# EAGLE design Sam7s64 (EAGLE 6.5.0)
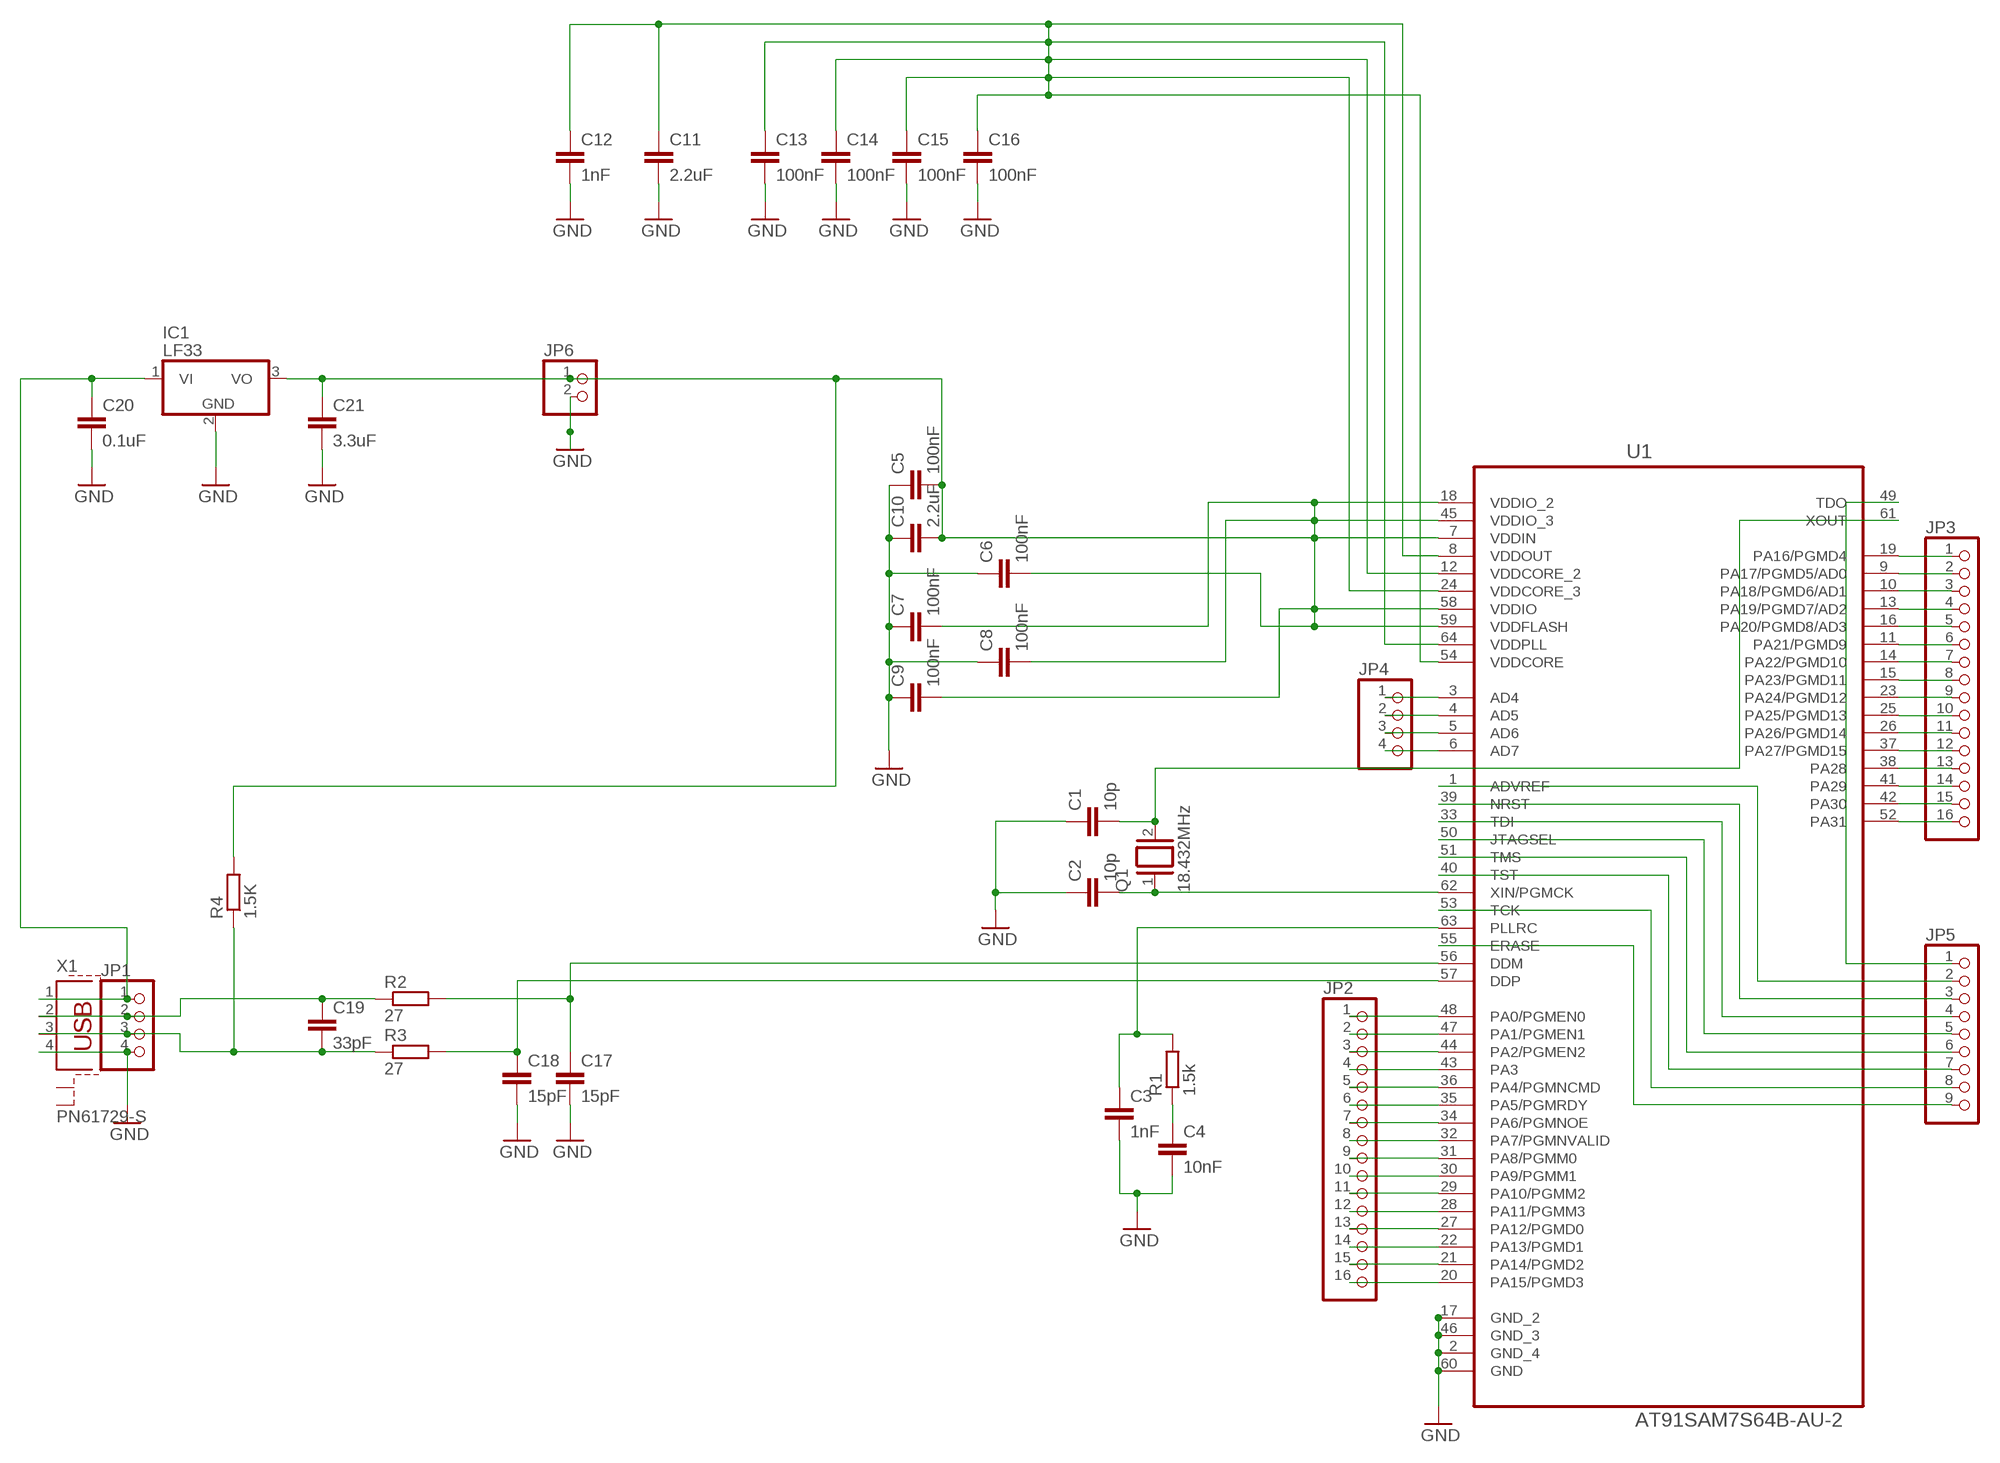
[diagram p0: schematic, sheet 1]

## Parts
C1  10p  C5/2.5  [C5B2.5]
C2  10p  C5/2.5  [C5B2.5]
C3  1nF  C5/2.5  [C5B2.5]
C4  10nF  C5/2.5  [C5B2.5]
C5  100nF  C5/2.5  [C5B2.5]
C6  100nF  C5/2.5  [C5B2.5]
C7  100nF  C5/2.5  [C5B2.5]
C8  100nF  C5/2.5  [C5B2.5]
C9  100nF  C5/2.5  [C5B2.5]
C10  2.2uF  C2.5/2  [C2.5-2]
C11  2.2uF  C2.5/2  [C2.5-2]
C12  1nF  C5/2.5  [C5B2.5]
C13  100nF  C5/2.5  [C5B2.5]
C14  100nF  C5/2.5  [C5B2.5]
C15  100nF  C5/2.5  [C5B2.5]
C16  100nF  C5/2.5  [C5B2.5]
C17  15pF  C5/2.5  [C5B2.5]
C18  15pF  C5/2.5  [C5B2.5]
C19  33pF  C5/2.5  [C5B2.5]
C20  0.1uF  C2.5/2  [C2.5-2]
C21  3.3uF  C2.5/2  [C2.5-2]
IC1  LF33  7805TV  [TO220V]
JP1  PINHD-1X4  [1X04]
JP2  PINHD-1X16  [1X16]
JP3  PINHD-1X16  [1X16]
JP4  PINHD-1X4  [1X04]
JP5  PINHD-1X9  [1X09]
JP6  PINHD-1X2  [1X02]
Q1  18.432MHz  XTAL/S  [QS]
R1  1.5k  R-EU_0207/10  [0207/10]
R2  27  R-EU_0207/10  [0207/10]
R3  27  R-EU_0207/10  [0207/10]
R4  1.5K  R-EU_0207/10  [0207/10]
U1  AT91SAM7S64B-AU-2  [QFP50P1200X1200X160-64N]
X1  PN61729-S  [PN61729-S]

## Nets
GND: C1.1 C2.1 C3.2 C4.2 C5.1 C6.1 C7.1 C8.1 C9.1 C10.1 C11.2 C12.2 C13.2 C14.2 C15.2 C16.2 C17.2 C18.2 C20.2 C21.2 IC1.2(GND) JP1.4 JP6.2 U1.2(GND_4) U1.17(GND_2) U1.46(GND_3) U1.60(GND) X1.4
N$1: C1.2 Q1.2 U1.61(XOUT)
N$2: C2.2 Q1.1 U1.62(XIN/PGMCK)
N$4: C17.1 R2.2 U1.56(DDM)
N$5: C3.1 R1.2 U1.63(PLLRC)
N$6: C5.2 C6.2 C7.2 C8.2 C9.2 C10.2 C21.1 IC1.3(VO) JP6.1 R4.2 U1.7(VDDIN) U1.18(VDDIO_2) U1.45(VDDIO_3) U1.58(VDDIO) U1.59(VDDFLASH)
N$7: C4.1 R1.1
N$9: C18.1 R3.2 U1.57(DDP)
N$11: C19.1 JP1.2 R2.1 X1.2
N$12: C19.2 JP1.3 R3.1 R4.1 X1.3
N$15: C20.1 IC1.1(VI) JP1.1 X1.1
N$16: C11.1 C12.1 C13.1 C14.1 C15.1 C16.1 U1.8(VDDOUT) U1.12(VDDCORE_2) U1.24(VDDCORE_3) U1.54(VDDCORE) U1.64(VDDPLL)
N$20: JP4.1 U1.3(AD4)
N$21: JP4.2 U1.4(AD5)
N$22: JP4.3 U1.5(AD6)
N$23: JP4.4 U1.6(AD7)
N$24: JP2.1 U1.48(PA0/PGMEN0)
N$25: JP2.2 U1.47(PA1/PGMEN1)
N$26: JP2.3 U1.44(PA2/PGMEN2)
N$27: JP2.4 U1.43(PA3)
N$28: JP2.5 U1.36(PA4/PGMNCMD)
N$29: JP2.6 U1.35(PA5/PGMRDY)
N$30: JP2.7 U1.34(PA6/PGMNOE)
N$31: JP2.8 U1.32(PA7/PGMNVALID)
N$32: JP2.9 U1.31(PA8/PGMM0)
N$33: JP2.10 U1.30(PA9/PGMM1)
N$34: JP2.11 U1.29(PA10/PGMM2)
N$35: JP2.12 U1.28(PA11/PGMM3)
N$36: JP2.13 U1.27(PA12/PGMD0)
N$37: JP2.14 U1.22(PA13/PGMD1)
N$38: JP2.15 U1.21(PA14/PGMD2)
N$39: JP2.16 U1.20(PA15/PGMD3)
N$40: JP3.1 U1.19(PA16/PGMD4)
N$41: JP3.2 U1.9(PA17/PGMD5/AD0)
N$42: JP3.3 U1.10(PA18/PGMD6/AD1)
N$43: JP3.4 U1.13(PA19/PGMD7/AD2)
N$44: JP3.5 U1.16(PA20/PGMD8/AD3)
N$45: JP3.6 U1.11(PA21/PGMD9)
N$46: JP3.7 U1.14(PA22/PGMD10)
N$47: JP3.8 U1.15(PA23/PGMD11)
N$48: JP3.9 U1.23(PA24/PGMD12)
N$49: JP5.2 U1.1(ADVREF)
N$50: JP5.3 U1.39(NRST)
N$51: JP5.4 U1.33(TDI)
N$52: JP5.5 U1.50(JTAGSEL)
N$53: JP5.6 U1.51(TMS)
N$54: JP5.7 U1.40(TST)
N$55: JP5.8 U1.53(TCK)
N$56: JP5.9 U1.55(ERASE)
N$57: JP5.1 U1.49(TDO)
N$58: JP3.10 U1.25(PA25/PGMD13)
N$59: JP3.11 U1.26(PA26/PGMD14)
N$60: JP3.12 U1.37(PA27/PGMD15)
N$61: JP3.13 U1.38(PA28)
N$62: JP3.14 U1.41(PA29)
N$63: JP3.15 U1.42(PA30)
N$64: JP3.16 U1.52(PA31)
Unconnected: X1.S1 X1.S2

## Library data of the parts
C1-C21 = 0myLib:C: CAPACITOR naming: grid - package width
IC1 = 0myLib:78*: Positive VOLTAGE REGULATOR Source: http://cache.national.com/ds/LM/LM78L05.pdf http://www.fairchildsemi.com/ds/LM/LM7805.pdf
JP1 JP4 = 0myLib:PINHD-1X4: PIN HEADER
JP2 JP3 = 0myLib:PINHD-1X16: PIN HEADER
JP5 = 0myLib:PINHD-1X9: PIN HEADER
JP6 = 0myLib:PINHD-1X2: PIN HEADER
Q1 = 0myLib:XTAL/S: CRYSTAL
R1-R4 = 0myLib:R-EU_: RESISTOR, European symbol
U1 = 0myLib:AT91SAM7S64B-AU-2: AT91 ARM Thumb-based Microcontrollers; DESCRIPTION: AT91 ARM Thumb-based Microcontrollers; MPN: AT91SAM7S64B-AU; OC_FARNELL: 1699393; OC_NEWARK: -; PACKAGE: QFP-64; SUPPLIER: Atmel
X1 = 0myLib:PN61729-S: BERG USB connector; OC_FARNELL: unknown; OC_NEWARK: unknown

## Board
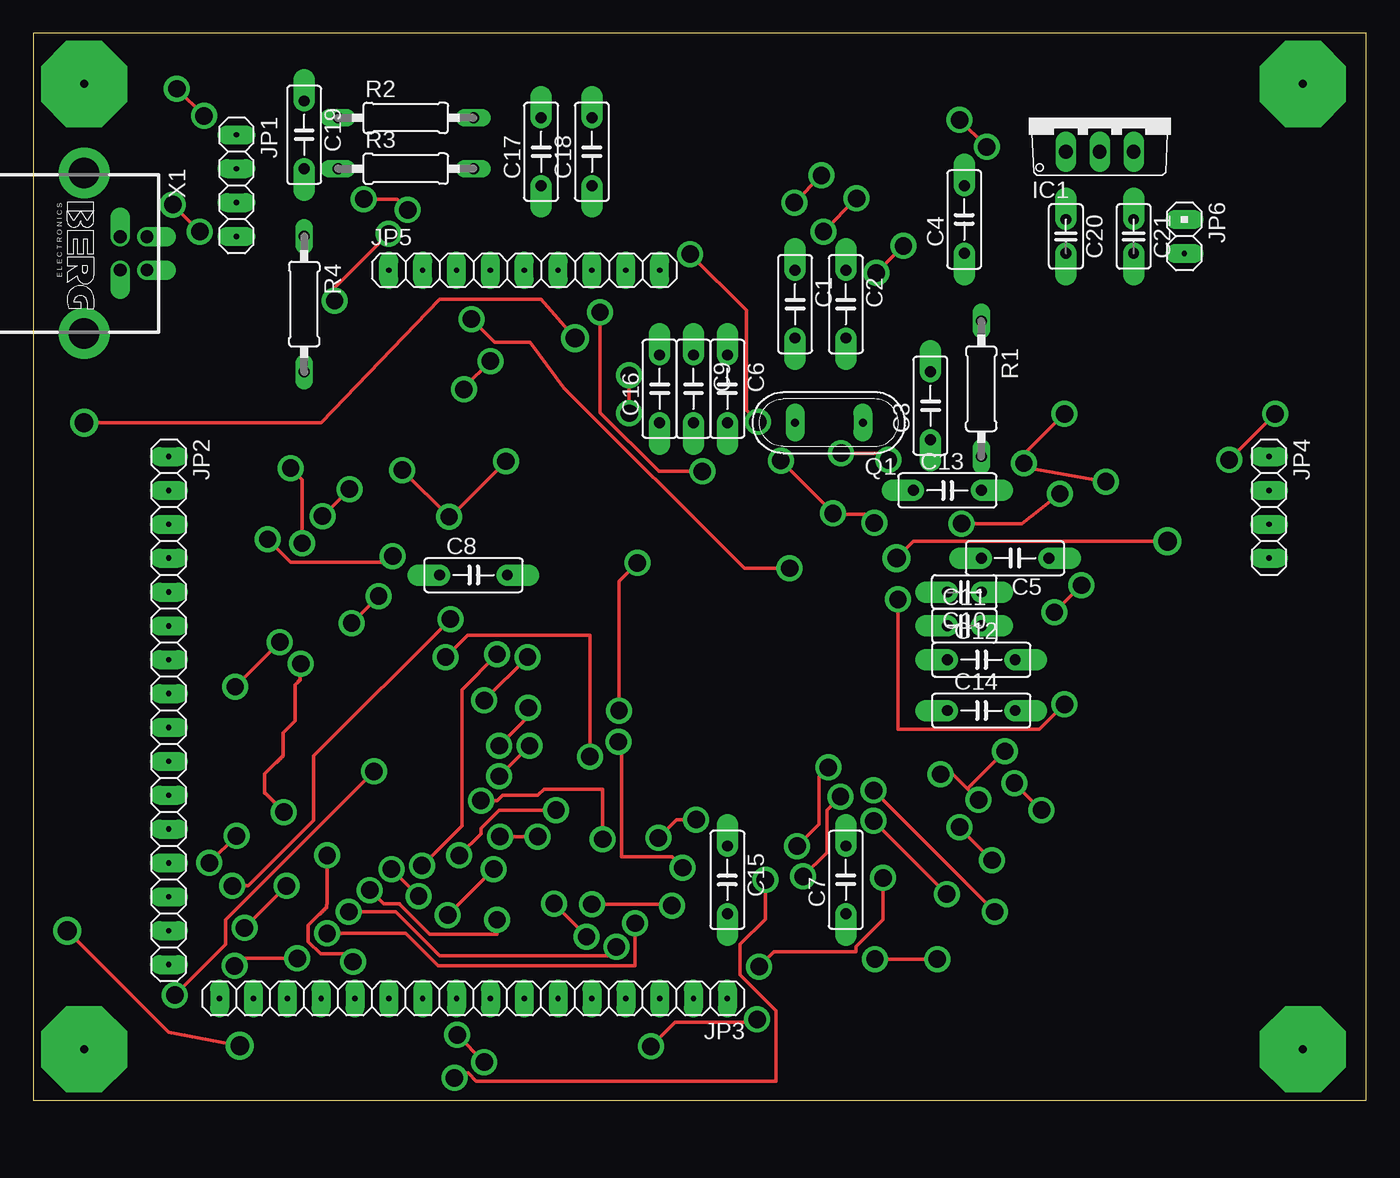
[diagram p1: board, top side]
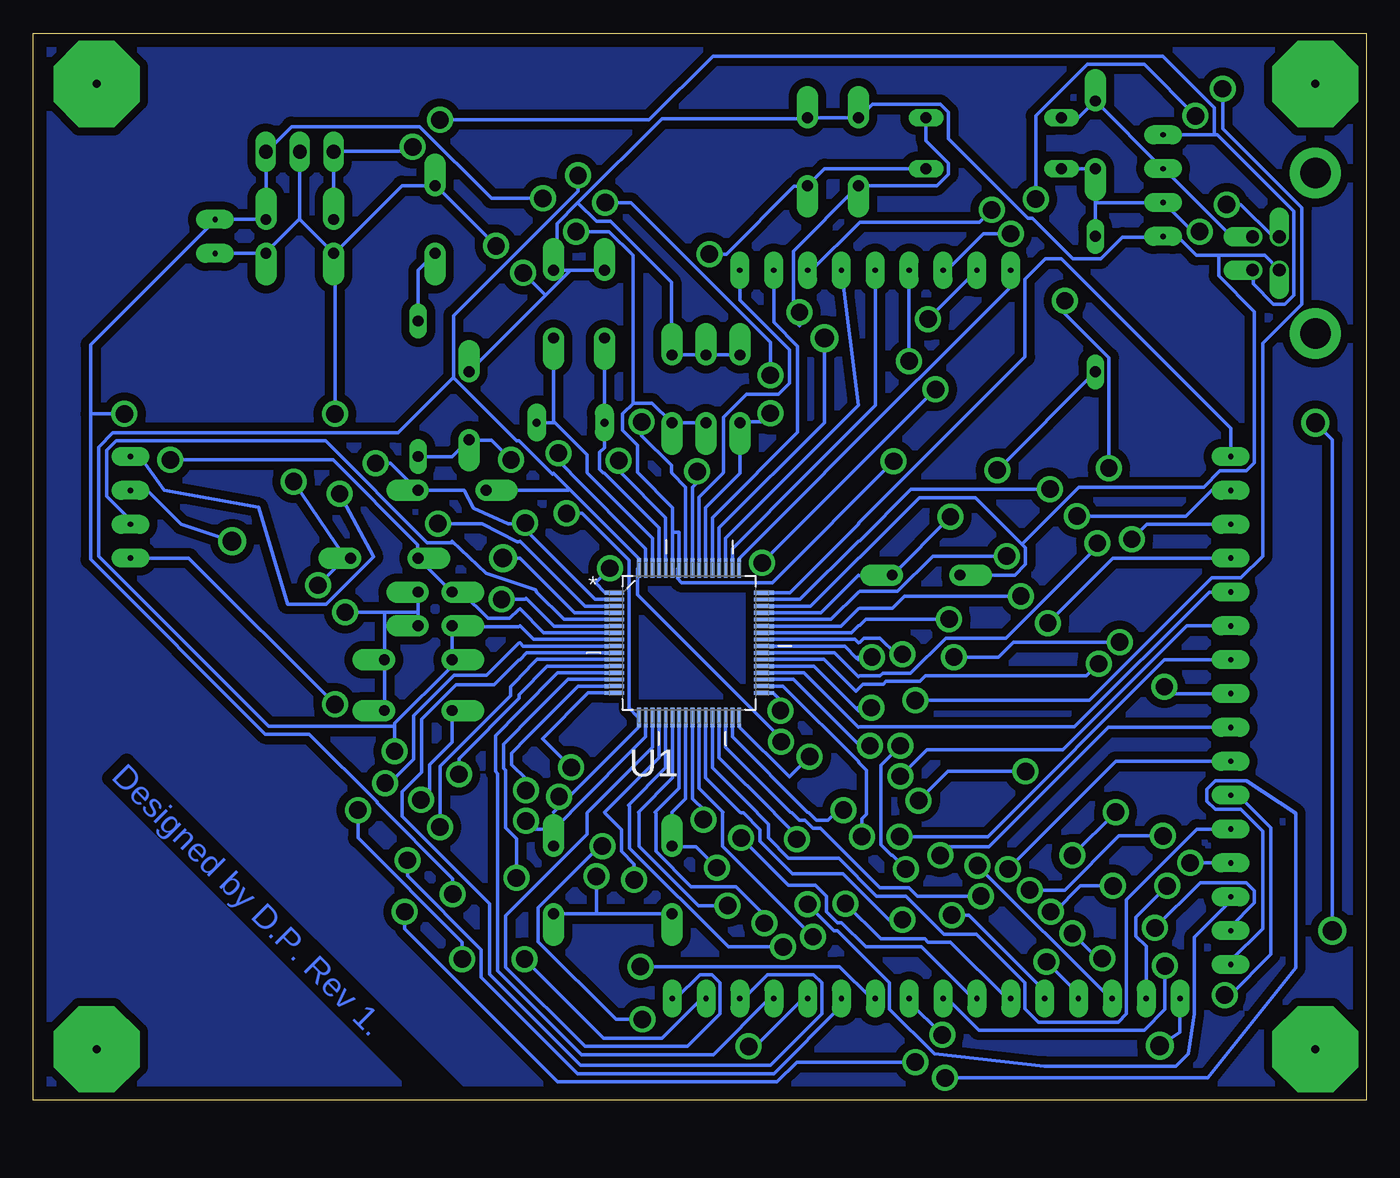
[diagram p2: board, bottom side, seen from below]

Size 100 x 80 mm. Coordinates in mm from the lower left corner, seen from the top.
Outline: 0,0 100,0 100,80 0,80 0,0
Copper layers (1*16): Top 0.035mm / dielectric 1.5mm / Bottom 0.035mm
Design rules "Design4_SMD *": minimum track width 11mil, minimum drill 1.3mm, track to track 24mil, track to pad 24mil, pad to pad 24mil, via to via 24mil, smd to smd 24mil, copper to edge 40mil, drill to drill 20mil, minimum pad ring 10mil, minimum via ring 10mil, stop-mask expansion 4mil, vias tented up to drill 0mil, thermal gap 10mil
tRestrict: area 14,63.5 to 16.5,73.7; area 6.3,59.7 to 8.9,67.3; area 19.1,68.6 to 21.6,76.2; area 21.6,68.6 to 34.3,74.9; area 38.1,67.3 to 43.2,76.2; area 25.4,61 to 48.3,63.5; area 19.1,53.3 to 21.6,66; area 45.7,49.5 to 53.3,57.2; area 55.9,55.9 to 62.2,63.5; area 55.9,49.5 to 63.5,52.1; area 68.6,62.2 to 71.1,69.8; area 69.8,47 to 72.4,59.7; 12 more areas
vRestrict: area 44.5,29.2 to 54.6,39.4; area 14,63.5 to 16.5,73.7; area 6.3,59.7 to 8.9,67.3; area 14,63.5 to 16.5,73.7; area 19.1,68.6 to 21.6,76.2; area 21.6,68.6 to 34.3,74.9; area 38.1,67.3 to 41.9,76.2; area 76.2,69.8 to 82.5,72.4; area 68.6,62.2 to 71.1,69.8; area 55.9,55.9 to 62.2,63.5; area 45.7,49.5 to 53.3,57.2; area 55.9,49.5 to 63.5,52.1; 14 more areas

### Footprints (pad centres in the part's own frame; a part is rotated, then mirrored left to right if it is on the bottom)
C5B2.5 = drill 0.813 pad 1.6 offset: 1 -2.54,0; 2 2.54,0
C2.5-2 = drill 0.813 pad 1.6 offset: 1 -1.27,0; 2 1.27,0
TO220V = drill 1.016 long: 1 -2.54,-2.54; 2 0,-2.54; 3 2.54,-2.54
1X04 = drill 0.4 pad 1.422 long: 1 -3.81,0; 2 -1.27,0; 3 1.27,0; 4 3.81,0
1X16 = drill 0.4 pad 1.422 long: 1 -19.05,0; 2 -16.51,0; 3 -13.97,0; 4 -11.43,0; 5 -8.89,0; 6 -6.35,0; 7 -3.81,0; 8 -1.27,0; 9 1.27,0; 10 3.81,0; 11 6.35,0; 12 8.89,0; 13 11.43,0; 14 13.97,0; 15 16.51,0; 16 19.05,0
1X09 = drill 0.4 pad 1.422 long: 1 -10.16,0; 2 -7.62,0; 3 -5.08,0; 4 -2.54,0; 5 0,0; 6 2.54,0; 7 5.08,0; 8 7.62,0; 9 10.16,0
1X02 = drill 0.4 pad 1.422 long: 1 -1.27,0; 2 1.27,0
QS = drill 0.61 pad 1.422 long: 1 -2.54,0; 2 2.54,0
0207/10 = drill 0.813 long: 1 -5.08,0; 2 5.08,0
QFP50P1200X1200X160-64N = smd 1.473 x 0.279: 1 -5.613,3.759; 2 -5.613,3.251; 3 -5.613,2.743; 4 -5.613,2.261; 5 -5.613,1.753; 6 -5.613,1.245; 7 -5.613,0.762; 8 -5.613,0.254; 9 -5.613,-0.254; 10 -5.613,-0.762; 11 -5.613,-1.245; 12 -5.613,-1.753; 13 -5.613,-2.261; 14 -5.613,-2.743; 15 -5.613,-3.251; 16 -5.613,-3.759; 33 5.613,-3.759; 34 5.613,-3.251; 35 5.613,-2.743; 36 5.613,-2.261; 37 5.613,-1.753; 38 5.613,-1.245; 39 5.613,-0.762; 40 5.613,-0.254; 41 5.613,0.254; 42 5.613,0.762; 43 5.613,1.245; 44 5.613,1.753; 45 5.613,2.261; 46 5.613,2.743; 47 5.613,3.251; 48 5.613,3.759 | smd 0.279 x 1.473: 17 -3.759,-5.613; 18 -3.251,-5.613; 19 -2.743,-5.613; 20 -2.261,-5.613; 21 -1.753,-5.613; 22 -1.245,-5.613; 23 -0.762,-5.613; 24 -0.254,-5.613; 25 0.254,-5.613; 26 0.762,-5.613; 27 1.245,-5.613; 28 1.753,-5.613; 29 2.261,-5.613; 30 2.743,-5.613; 31 3.251,-5.613; 32 3.759,-5.613; 49 3.759,5.613; 50 3.251,5.613; 51 2.743,5.613; 52 2.261,5.613; 53 1.753,5.613; 54 1.245,5.613; 55 0.762,5.613; 56 0.254,5.613; 57 -0.254,5.613; 58 -0.762,5.613; 59 -1.245,5.613; 60 -1.753,5.613; 61 -2.261,5.613; 62 -2.743,5.613; 63 -3.251,5.613; 64 -3.759,5.613
PN61729-S = drill 0.95 offset: 1 1.25,4.71; 2 -1.25,4.71; 3 -1.25,2.71; 4 1.25,2.71 | drill 2.3 pad 3.81: S1 -6.02,0; S2 6.02,0

### Placement (x,y rotation side)
C1  57.15,59.69 270 top
C2  60.96,59.69 270 top
C3  67.31,52.07 90 top
C4  69.85,66.04 90 top
C5  73.66,40.64 180 top
C6  52.07,53.34 270 top
C7  60.96,16.51 90 top
C8  33.02,39.37 0 top
C9  49.53,53.34 270 top
C10  69.85,38.1 180 top
C11  69.85,35.56 0 top
C12  71.12,33.02 0 top
C13  68.58,45.72 0 top
C14  71.12,29.21 0 top
C15  52.07,16.51 270 top
C16  46.99,53.34 90 top
C17  38.1,71.12 90 top
C18  41.91,71.12 90 top
C19  20.32,72.39 270 top
C20  77.47,64.77 270 top
C21  82.55,64.77 270 top
IC1  80.01,73.66 0 top
JP1  15.24,68.58 270 top
JP2  10.16,29.21 270 top
JP3  33.02,7.62 180 top
JP4  92.71,44.45 270 top
JP5  36.83,62.23 0 top
JP6  86.36,64.77 270 top
Q1  59.69,50.8 180 top
R1  71.12,53.34 270 top
R2  27.94,73.66 0 top
R3  27.94,69.85 0 top
R4  20.32,59.69 270 top
U1  50.8,34.29 0 bottom
X1  3.81,63.5 270 top

### Tracks (layer width: path | path; a pad name or v marks a point on that pad's centre or on a via)
GND  (via drill 1.3)
  Top 0.279: v76.61,36.58 v78.64,38.61 | v56.08,47.95 59.99,44.04 v59.99,43.99 60.1,43.94 62.43,43.94 v63.09,43.28 | v57.76,16.76 59.54,18.54 59.54,21.74 v60.55,22.76 | v80.47,46.38 74.32,47.45 v74.32,47.75 74.37,47.85 74.37,48.46 v77.37,51.46 | v63.25,62.03 v65.28,64.06
  Bottom 0.279: U1.60 52.55,43.66 55.88,46.99 55.93,47.09 55.93,47.8 v56.08,47.95 | U1.2 57.86,37.54 63.5,43.18 63.6,43.23 64.36,43.23 | 60.17,22.38 54.56,27.99 U1.17 54.66,28.75 55.32,29.41 55.32,40.49 58.83,43.99 v59.99,43.99 | 60.17,22.38 60.96,21.59 | U1.46 41.71,37.03 38.1,40.64 38,40.69 33.53,45.16 29.31,45.16 25.83,41.68 | JP6.2 C21.2 82.5,63.6 80.01,66.09 | 80.01,66.09 IC1.2 | C20.2 79.96,65.99 80.01,66.09 | C20.2 77.37,63.55 72.34,68.58 C4.2 69.75,68.53 v65.28,64.06 | C14.2 C12.2 73.66,36.58 | C10.1 71.12,36.58 | 71.12,36.58 C11.2 | v78.64,38.61 76.61,40.64 C5.1 76.66,40.74 v80.47,46.38 | 71.12,36.58 73.66,36.58 | 73.66,36.58 v76.61,36.58 | C7.1 57.76,13.97 | 57.76,13.97 C15.2 | 64.36,43.23 66.95,44.37 67.67,45.72 C13.2 71.22,45.77 73.2,47.75 v74.32,47.75 | v63.09,43.28 64.36,43.23 | v57.76,16.76 57.76,13.97 | 60.17,22.38 v60.55,22.76 | v77.37,51.46 77.37,63.4 C20.2 | C8.1 26.36,39.37 25.55,40.18 25.55,41.4 25.83,41.68 | 11.07,63.35 7.62,63.35 6.55,62.28 X1.4 | 11.07,63.35 12.75,63.35 14.17,64.77 JP1.4 15.34,64.72 18.29,64.72 19.91,63.09 22,63.09 25.04,66.14 25.4,66.14 31.34,72.08 31.34,74.07 31.95,74.68 37.03,74.68 38,73.71 C17.2 C18.2 42.01,73.61 52.83,73.61 59.16,67.28 | C16.2 C9.1 C6.1 52.12,55.98 52.12,61.32 56.69,65.89 57.76,65.89 59.16,67.28 | 59.79,62.23 C2.1 60.71,62.33 60.71,65.73 59.16,67.28 | 59.79,62.23 C1.1 | 61.57,60.35 59.79,62.13 59.79,62.23 | 61.57,60.35 C3.2 | 25.83,41.68 21.54,45.97 12.19,45.97 10.97,47.19 8.99,47.19 8.38,47.8 8.38,59.13 11.07,61.82 11.07,63.35 | 61.57,60.35 v63.25,62.03
N$1
  Bottom 0.279: U1.61 53.06,42.9 57.15,46.99 57.25,47.04 57.51,47.3 57.51,48.56 57.15,48.92 Q1.2 C1.2
N$2
  Bottom 0.279: U1.62 53.54,42.11 58.42,46.99 58.47,47.09 58.47,48.41 60.86,50.8 60.96,50.8 | 60.96,50.8 Q1.1 | 60.96,50.8 C2.2
N$3  (via drill 0.6 pad 6.45)
  other vias: 3.81,76.2
N$4  (via drill 1.3)
  Top 0.279: v50.19,47.14 46.94,47.14 42.52,51.56 v42.52,59.08
  Bottom 0.279: U1.56 50.55,45.97 49.81,46.71 | 49.81,46.71 49.53,46.99 | R2.2 33.02,71.93 31.34,70.26 31.34,69.44 32.21,68.58 C17.1 38.15,68.48 42.98,63.65 42.98,58.52 42.52,58.06 v42.52,59.08 | 49.81,46.71 50.19,47.09 v50.19,47.14
N$5  (via drill 1.3)
  Top 0.279: v64.16,48.01 63.65,48.51 v60.6,48.51
  Bottom 0.279: U1.63 54.05,41.35 59.69,46.99 59.74,47.09 60.6,47.95 v60.6,48.51 | R1.2 68.58,48.26 C3.1 67.21,49.48 65.63,49.48 v64.16,48.01
N$6  (via drill 1.3)
  Top 0.279: v27.69,47.24 v31.19,43.74 31.29,43.74 v35.46,47.9 | v68.53,15.44 v63.04,20.93 | v93.17,51.46 v89.71,48.01 | v61.77,67.61 v59.28,65.13
  Bottom 0.279: U1.59 52.05,42.57 | 52.05,42.57 52.05,44.42 54.61,46.99 54.66,47.09 54.66,49.12 55.78,50.24 55.78,51.46 54.97,52.27 | U1.7 61.72,35.05 63.5,36.83 63.6,36.78 64.26,36.12 65.89,36.12 67.82,38.05 68.48,38.05 C10.2 C5.2 71.17,40.74 71.17,41.66 77.52,48.01 v89.71,48.01 | U1.18 54.05,27.23 59.69,21.59 59.74,21.49 60.96,20.27 C7.2 61.06,20.32 62.43,20.32 v63.04,20.93 | U1.45 40.92,36.55 38.1,39.37 38,39.32 35.66,39.32 C8.2 v31.19,43.74 | 52.05,42.57 51.56,42.57 U1.58 51.66,39.83 51.66,39.12 51.36,38.81 44.55,38.81 v35.46,47.9 | C9.2 C6.2 52.17,50.85 53.59,52.27 54.97,52.27 | v27.69,47.24 R4.2 | v68.53,15.44 68.53,16.61 74.22,22.3 74.22,22.35 79.3,27.43 82.6,27.43 95.71,40.54 95.71,51.46 | 95.71,51.46 95.71,56.64 86.41,65.94 JP6.1 C21.1 IC1.3 82.45,71.17 80.62,73 71.02,73 65.63,67.61 v61.77,67.61 | 95.71,51.46 v93.17,51.46 | v59.28,65.13 56.79,65.13 55.02,63.35 55.02,52.38 54.97,52.27
N$7
  Bottom 0.279: R1.1 71.12,62.23 C4.1
N$8  (via drill 0.6 pad 6.45)
  other vias: 3.81,3.81
N$9  (via drill 1.3)
  Top 0.279: v54.36,50.85 53.49,51.71 53.49,59.23 v49.28,63.45
  Bottom 0.279: U1.57 51.05,45.97 52.07,46.99 52.12,47.09 52.12,47.6 54.36,49.84 v54.36,50.85 | R3.2 40.64,69.85 C18.1 42.01,68.53 42.93,68.53 48.01,63.45 v49.28,63.45
N$10  (via drill 0.6 pad 6.45)
  other vias: 95.25,76.2
N$11
  Bottom 0.279: R2.1 21.59,73.66 C19.1 JP1.2 15.14,69.8 10.11,64.77 8.53,64.77 X1.2
N$12  (via drill 1.3)
  Top 0.279: v12.5,65.13 v10.46,67.16
  Bottom 0.279: 20.32,67.31 C19.2 R3.1 | 20.32,67.31 R4.1 | 20.32,67.31 JP1.3 15.14,67.26 13.01,65.13 v12.5,65.13 | v10.46,67.16 9.4,67.16 7.01,64.77 6.55,64.77 X1.3
N$13  (via drill 0.6 pad 6.45)
  other vias: 95.25,3.81
N$14
  pour Bottom: 0,80.01 0,0 100.33,0 100.33,80.01
N$15  (via drill 1.3)
  Top 0.279: v69.49,73.51 v71.53,71.48
  Bottom 0.279: C20.1 IC1.1 77.37,71.17 71.83,71.17 v71.53,71.48 | 11.38,72.39 11.18,72.39 5.44,66.65 5.44,60.35 6.1,59.69 6.96,59.69 8.48,61.21 8.48,62.23 X1.1 | 11.38,72.39 JP1.1 | v69.49,73.51 53.8,73.51 49.02,78.28 15.24,78.28 11.38,74.42 11.38,72.39
N$16  (via drill 1.3)
  Top 0.279: 70.08,23.34 68.99,24.43 v68.07,24.43 | 70.08,23.34 v70.92,22.5 | 70.08,23.34 v72.9,26.16 | v48.72,17.42 47.9,18.24 44.15,18.24 44.15,26.62 v43.89,26.87 | v44.7,54.36 v44.7,51.51 | v59.13,69.34 v57.1,67.31
  Bottom 0.279: U1.54 49.55,44.42 46.99,46.99 C16.1 46.89,50.85 45.36,50.85 v44.7,51.51 | 59.77,45.8 54.56,40.59 U1.64 54.66,39.83 54.66,37.9 43.89,27.13 v43.89,26.87 | 59.77,45.8 60.96,46.99 61.06,46.94 63.55,49.43 63.75,49.43 68.48,54.15 | U1.8 62.48,34.54 63.5,35.56 63.6,35.51 68.48,35.51 C11.1 C12.1 68.63,32.92 68.63,32.51 72.9,28.25 72.9,28.04 | U1.12 61.44,32.54 63.5,30.48 63.55,30.38 63.55,30.12 68.07,25.6 v68.07,24.43 | U1.24 51.05,22.61 52.07,21.59 C15.1 51.97,19 50.29,19 v48.72,17.42 | C14.1 68.58,26.82 70.26,25.15 70.26,23.16 v70.92,22.5 | v72.9,26.16 72.9,28.04 | C13.1 59.84,45.72 59.77,45.8 | v44.7,54.36 44.7,56.84 55.17,67.31 v57.1,67.31 | v59.13,69.34 59.13,68.17 68.48,58.83 68.48,54.15 | 72.9,28.04 82.35,28.04 95.1,40.79 95.1,48.97 94.03,50.04 72.64,50.04 68.58,54.1 68.48,54.15
N$20  (via drill 1.3)
  Top 0.279: v77.01,45.47 74.17,43.23 v69.65,43.23
  Bottom 0.279: U1.3 58.62,37.03 63.5,41.91 63.6,41.86 63.7,41.86 66.34,43.23 v69.65,43.23 | JP4.1 92,48.26 90.17,45.72 83.11,44.45 80.92,37.19 78.03,37.19 74.47,40.74 v77.01,45.47
N$21  (via drill 1.4)
  Top 0.279: v85.09,41.91 66.04,41.91 v64.77,40.64
  Bottom 0.279: U1.4 59.41,36.55 63.5,40.64 v64.77,40.64 | JP4.2 91.44,45.72 88.9,43.18 v85.09,41.91
N$22
  Bottom 0.279: U1.5 60.17,36.04 62.23,38.1 62.33,38.28 66.04,39.5 68.58,41.91 68.58,41.81 | JP4.3 92.71,43.48 94.49,45.26 94.49,48.72 93.78,49.43 78.08,49.43 70.46,41.81 68.58,41.81 | 68.58,41.81 68.53,41.81
N$23  (via drill 1.3)
  Top 0.279: v77.37,29.67 75.49,27.79 64.87,27.79 v64.87,37.54
  Bottom 0.279: U1.6 60.94,35.53 63.02,37.62 63.09,37.54 v64.87,37.54 | JP4.4 88.34,40.64 v77.37,29.67
N$24
  Bottom 0.279: U1.48 43.23,38.05 38.1,43.18 38.05,43.28 25.6,55.73 25.6,61.57 24.08,63.09 22.86,63.09 10.16,50.39 JP2.1
N$25  (via drill 1.3)
  Top 0.279: v23.72,45.82 v21.69,43.79
  Bottom 0.279: U1.47 42.47,37.54 38.1,41.91 38,41.96 34.14,45.82 v23.72,45.82 | JP2.2 11.58,45.72 13.51,43.79 v21.69,43.79
N$26  (via drill 1.3)
  Top 0.279: v17.58,42.06 19.3,40.34 26.98,40.34 v26.98,40.79
  Bottom 0.279: U1.44 40.16,36.04 38.1,38.1 38,38.15 35.15,38.15 32.51,40.79 v26.98,40.79 | JP2.3 16.46,43.18 v17.58,42.06
N$27  (via drill 1.3)
  Top 0.279: v25.91,37.8 v23.88,35.76
  Bottom 0.279: U1.43 39.4,35.53 38.1,36.83 38,36.88 35.56,36.88 34.65,37.8 v25.91,37.8 | JP2.4 19,40.64 v23.88,35.76
N$28
  Bottom 0.279: U1.36 42.19,32.03 38.1,27.94 38,27.99 21.89,27.99 11.79,38.1 JP2.5
N$29  (via drill 1.3)
  Top 0.279: v37.24,26.57 v34.95,24.28
  Bottom 0.279: U1.35 42.98,31.55 38.1,26.67 38.05,26.57 v37.24,26.57 | JP2.6 13.46,35.56 22.76,26.26 32.97,26.26 v34.95,24.28
N$30  (via drill 1.3)
  Top 0.279: v37.85,19.76 v35,19.76
  Bottom 0.279: U1.34 43.74,31.04 38.1,25.4 38.05,25.3 37.49,24.74 37.49,21.44 37.85,21.08 v37.85,19.76 | JP2.7 15.14,33.02 28.4,19.76 v35,19.76
N$31  (via drill 1.3)
  Top 0.279: v18.49,34.34 v15.14,30.99 | v30.94,33.22 32.56,34.85 41.76,34.85 v41.76,25.76
  Bottom 0.279: U1.32 47.04,27.99 43.28,24.23 v41.76,25.76 | JP2.8 14.63,30.48 v15.14,30.99 | v18.49,34.34 26.47,34.34 27.58,33.22 v30.94,33.22
N$32  (via drill 1.3)
  Top 0.279: v31.95,18.34 33.58,19.96 33.58,20.37 34.95,21.74 v39.22,21.74
  Bottom 0.279: U1.31 47.55,27.23 41.91,21.59 41.81,21.54 41.25,20.98 40.39,20.98 39.62,21.74 v39.22,21.74 | JP2.9 19.36,27.94 28.3,19 31.29,19 v31.95,18.34
N$33  (via drill 1.3)
  Top 0.279: v28.91,15.29 v26.87,17.32
  Bottom 0.279: U1.30 48.06,26.47 43.18,21.59 43.08,21.54 42.52,20.98 42.11,20.98 41.5,20.37 40.95,20.37 36.47,15.9 34.29,15.9 33.68,15.29 v28.91,15.29 | JP2.10 18.8,25.4 v26.87,17.32
N$34  (via drill 1.3)
  Top 0.279: v10.62,7.87 14.43,11.68 14.43,13.51 v25.55,24.64 | v33.58,22.45 34.8,22.45 35.2,22.86 37.85,22.86 38.3,23.32 42.72,23.32 v42.72,19.56
  Bottom 0.279: U1.29 48.54,25.68 44.45,21.59 44.4,21.49 42.72,19.81 v42.72,19.56 | JP2.11 9.6,22.86 7.16,20.42 7.16,10.92 10.21,7.87 v10.62,7.87 | v25.55,24.64 31.39,24.64 v33.58,22.45
N$35
  Bottom 0.279: U1.28 49.05,24.92 45.72,21.59 45.67,21.49 44.86,20.68 44.86,19.66 43.33,18.14 39.57,18.14 36.73,15.29 34.54,15.29 31.7,12.45 29.26,12.45 25.6,8.79 25.6,6.86 24.59,5.84 18.59,5.84 17.98,6.45 17.98,15.04 12.7,20.32 JP2.12
N$36  (via drill 1.3)
  Top 0.279: v15.24,19.81 v13.21,17.78 | v25.25,15.75 26.26,14.73 27.48,14.73 27.48,14.68 29.72,12.45 34.8,12.45 v34.8,13.51
  Bottom 0.279: U1.27 49.55,24.16 46.99,21.59 46.89,21.54 46.74,21.54 45.47,20.27 45.47,19.41 43.03,16.97 39.27,16.97 35.81,13.51 v34.8,13.51 | v13.21,17.78 JP2.13 | v15.24,19.81 18.54,19.81 22.61,15.75 v25.25,15.75
N$37  (via drill 1.3)
  Top 0.279: v41.91,14.68 47.9,14.68 v47.9,14.58
  Bottom 0.279: U1.22 52.05,24.16 54.61,21.59 54.56,21.49 54.56,19.05 50.09,14.58 v47.9,14.58 | JP2.14 10.16,14.94 12.9,12.19 12.9,6.45 13.36,3.45 14.28,2.54 24.13,2.54 32.41,3.45 35.76,6.81 35.76,8.79 39.67,12.7 39.93,12.7 v41.91,14.68
N$38  (via drill 1.3)
  Top 0.279: v19,16.05 v15.85,12.9 | v23.67,14.12 27.18,14.12 30.48,10.82 43.74,10.82 v43.74,11.48
  Bottom 0.279: U1.21 52.55,24.92 55.35,22.12 55.27,22.05 55.27,18.9 47.85,11.48 v43.74,11.48 | JP2.15 10.16,13.01 8.38,14.78 8.38,15.7 8.99,16.31 12.45,16.31 v15.85,12.9 | v19,16.05 21.44,16.05 23.37,14.12 v23.67,14.12
N$39  (via drill 1.3)
  Top 0.279: v31.6,1.65 32.61,2.03 33.22,1.42 55.73,1.42 55.73,6.71 53.03,9.4 53.03,11.68 54.91,13.56 v54.91,16.51
  Bottom 0.279: U1.20 53.06,25.68 57.15,21.59 57.1,21.49 55.88,20.27 55.88,18.64 54.91,17.68 v54.91,16.51 | JP2.16 10.16,10.46 7.77,12.85 7.77,20.17 9.4,21.79 11.33,21.79 11.94,22.4 11.94,23.32 11.33,23.93 8.99,23.93 5.28,21.49 5.28,9.91 11.89,1.65 v31.6,1.65
N$40
  Bottom 0.279: U1.19 53.54,26.47 58.42,21.59 58.47,21.49 58.47,19.91 64.57,13.82 64.57,9.96 58.62,4.01 50.9,4.01 48.46,6.45 48.46,8.79 49.07,9.4 49.99,9.4 51.77,7.62 JP3.1
N$41  (via drill 1.3)
  Top 0.279: v67.82,10.57 v63.14,10.57 | v73.61,23.77 v75.64,21.74
  Bottom 0.279: U1.9 63.25,34.04 63.5,34.29 63.6,34.24 65.99,31.85 68.43,31.85 71.48,28.8 71.48,25.55 73.25,23.77 v73.61,23.77 | JP3.2 49.84,7.62 52.83,4.62 57.2,4.62 v63.14,10.57 | v67.82,10.57 67.82,11.84 75.64,19.66 v75.64,21.74
N$42
  Bottom 0.279: U1.10 62.99,33.53 63.5,33.02 63.6,32.97 65.43,31.14 68.28,31.14 70.87,28.55 70.87,24.59 72.34,23.11 72.34,21.29 65.79,14.73 65.79,9.45 58.93,2.59 44.7,2.59 40.84,6.45 40.84,8.79 41.45,9.4 44.91,9.4 46.69,7.62 JP3.3
N$43
  Bottom 0.279: U1.13 60.68,32.03 63.5,29.21 63.55,29.11 65.33,27.33 65.33,24.64 65.18,24.49 65.18,9.7 58.88,3.4 48.97,3.4 44.76,7.62 JP3.4
N$44  (via drill 1.3)
  Top 0.279: v46.33,4.01 48.16,5.84 54.3,5.84 v54.3,6.04 | v57.3,19.05 58.93,20.68 58.93,24.23 v59.64,24.94
  Bottom 0.279: U1.16 58.37,30.53 61.8,27.1 v59.64,24.94 | JP3.5 42.22,7.62 45.82,4.01 v46.33,4.01 | v54.3,6.04 56.29,6.04 62.13,11.89 62.13,14.43 57.51,19.05 v57.3,19.05
N$45  (via drill 1.3)
  Top 0.279: v71.93,17.98 69.49,20.42 v69.49,20.47
  Bottom 0.279: U1.11 62.2,33.05 63.5,31.75 63.55,31.65 64.21,30.99 64.21,30.33 69.49,25.04 v69.49,20.47 | JP3.6 39.37,7.06 44.45,1.98 59.18,1.98 66.4,9.2 66.4,11.28 71.93,16.82 v71.93,17.98
N$46  (via drill 1.3)
  Top 0.279: v54.46,10.01 55.58,11.12 61.72,11.12 61.72,11.48 63.75,13.51 v63.75,16.66
  Bottom 0.279: U1.14 59.89,31.55 63.5,27.94 63.55,27.84 64.72,26.67 64.72,24.89 64.57,24.74 64.57,20.42 63.75,19.61 v63.75,16.66 | JP3.7 37.13,7.62 39.52,10.01 v54.46,10.01
N$47  (via drill 1.3)
  Top 0.279: v33.83,2.85 v31.8,4.88 | v63.04,23.22 v72.14,14.12
  Bottom 0.279: U1.15 59.13,31.04 63.5,26.67 63.55,26.57 64.11,26.01 64.11,25.15 63.04,24.08 v63.04,23.22 | JP3.8 34.29,7.37 v31.8,4.88 | v33.83,2.85 42.72,2.85 44.2,1.37 60.66,1.37 72.14,12.85 v72.14,14.12
N$48  (via drill 1.3)
  Top 0.279: v15.09,10.06 15.65,10.62 v19.81,10.62 | v22.05,12.5 27.94,12.5 30.38,10.06 45.16,10.06 v45.16,13.26
  Bottom 0.279: U1.23 51.56,23.37 53.34,21.59 53.29,21.49 53.29,18.64 50.65,16 47.3,16 45.16,13.87 v45.16,13.26 | JP3.9 31.45,7.62 29.06,5.23 16.66,5.23 15.09,6.81 v15.09,10.06 | v19.81,10.62 20.17,10.62 v22.05,12.5
N$49  (via drill 1.3)
  Top 0.279: v32.87,58.57 34.59,56.84 37.29,56.84 39.83,53.39 53.34,39.88 v56.74,39.88
  Bottom 0.279: U1.1 57.1,38.05 57.84,38.79 v56.74,39.88 | v32.87,58.57 JP5.2
N$50  (via drill 1.3)
  Top 0.279: v26.67,64.97 22.61,60.91 v22.61,59.94 | v19.3,47.4 20.17,46.53 v20.17,41.76
  Bottom 0.279: U1.39 39.88,33.53 38.1,31.75 38,31.8 36.47,31.8 36.27,32 34.19,32 31.55,34.65 27.03,34.65 20.17,41.5 v20.17,41.76 | JP5.3 31.45,62.23 28.7,64.97 v26.67,64.97 | v22.61,59.94 22.61,58.98 19.3,55.68 v19.3,47.4
N$51  (via drill 1.3)
  Top 0.279: v34.29,55.42 32.31,53.44 v32.31,53.29 | v45.31,40.28 43.94,38.91 v43.94,29.21
  Bottom 0.279: U1.33 44.5,30.53 43.56,29.59 v43.94,29.21 | v34.29,55.42 JP5.4 | v45.31,40.28 v32.31,53.29
N$52
  Bottom 0.279: U1.50 47.55,41.35 41.91,46.99 41.86,47.09 36.83,52.12 JP5.5
N$53
  Bottom 0.279: U1.51 48.06,42.11 43.18,46.99 43.13,47.09 38.1,52.12 JP5.6
N$54  (via drill 1.3)
  Top 0.279: v28.09,66.75 27.28,67.56 v24.79,67.56 | v10.77,75.84 v12.8,73.81 | v37.08,33.22 v33.83,29.97
  Bottom 0.279: U1.40 39.12,34.04 38.23,33.15 | 38.23,33.15 38.1,33.02 | JP5.7 41.6,62.23 38,65.84 29.01,65.84 v28.09,66.75 | v24.79,67.56 24.79,73.81 20.93,77.67 16.66,77.67 v12.8,73.81 | v10.77,75.84 10.77,72.85 4.83,66.9 4.83,59.69 7.77,56.74 7.77,40.79 9.4,39.17 11.58,39.17 20.78,29.97 v33.83,29.97 | v37.08,33.22 38.15,33.22 38.23,33.15
N$55
  Bottom 0.279: U1.53 49.05,43.66 45.72,46.99 45.67,47.09 42.67,50.09 42.67,56.54 44.45,58.32 JP5.8
N$56
  Bottom 0.279: U1.55 50.04,45.21 48.26,46.99 48.21,47.09 48.21,51.21 46.48,52.93 44.09,52.93 43.28,53.75 43.28,56.29 46.99,59.99 JP5.9
N$57
  Bottom 0.279: U1.49 47.04,40.59 40.64,46.99 40.59,47.09 26.67,61.01 JP5.1
N$58  (via drill 1.3)
  Top 0.279: v46.89,19.66 48.26,21.03 v49.73,21.03
  Bottom 0.279: U1.25 50.55,22.61 49.66,21.72 | 49.66,21.72 49.53,21.59 | JP3.10 29.52,7.62 33.38,11.48 37.54,11.48 39.37,13.31 39.67,13.31 40.49,14.12 40.49,15.29 41.3,16.1 43.33,16.1 v46.89,19.66 | v49.73,21.03 49.73,21.64 49.66,21.72
N$59  (via drill 1.3)
  Top 0.279: v39.06,14.73 41.5,12.29 v41.5,12.24
  Bottom 0.279: U1.26 50.04,23.37 48.26,21.59 48.31,21.49 48.31,19.05 v41.5,12.24 | JP3.11 26.98,7.62 31.19,11.84 32.87,11.84 33.12,12.09 36.42,12.09 v39.06,14.73
N$60  (via drill 1.3)
  Top 0.279: v34.54,17.32 v31.09,13.87 | v34.95,26.57 37.13,28.75 v37.13,29.41
  Bottom 0.279: U1.37 41.43,32.54 38.23,29.34 | 38.23,29.34 38.1,29.21 | JP3.12 24.13,8.18 29.82,13.87 v31.09,13.87 | v34.54,17.32 35.56,18.34 35.61,18.34 36.42,19.15 36.42,25.09 v34.95,26.57 | v37.13,29.41 38.15,29.41 38.23,29.34
N$61  (via drill 1.3)
  Top 0.279: v23.98,10.36 23.93,10.41 23.93,10.46 23.88,10.52 23.82,10.52 23.77,10.57 23.77,10.62 23.72,10.67 23.67,10.67 23.62,10.72 23.62,10.77 23.57,10.82 23.52,10.82 23.47,10.87 23.47,10.92 23.42,10.97 21.54,10.97 20.62,11.89 20.62,13.11 21.44,13.92 21.49,13.92 21.54,13.97 21.54,14.02 21.59,14.07 21.64,14.07 21.69,14.12 21.69,14.17 21.74,14.22 21.79,14.22 21.84,14.28 21.84,14.33 21.89,14.38 21.95,14.38 22,14.43 22,14.63 22.05,14.68 v22.05,18.34 | v18.8,21.59 18.75,21.64 18.75,21.69 18.69,21.74 18.64,21.74 18.59,21.79 18.59,21.84 18.54,21.89 18.49,21.89 18.44,21.95 18.44,22 18.39,22.05 18.34,22.05 18.29,22.1 18.29,22.15 18.24,22.2 18.19,22.2 18.14,22.25 18.14,22.3 18.09,22.35 18.03,22.35 17.98,22.4 17.98,22.45 17.93,22.5 17.88,22.5 17.83,22.55 17.83,22.61 17.78,22.66 17.73,22.66 17.68,22.71 17.68,22.76 17.63,22.81 17.58,22.81 17.53,22.86 17.53,22.91 17.48,22.96 17.42,22.96 17.37,23.01 17.37,24.49 18.19,25.3 18.24,25.3 18.29,25.35 18.29,25.4 18.34,25.45 18.39,25.45 18.44,25.5 18.44,25.55 18.49,25.6 18.54,25.6 18.59,25.65 18.59,25.7 18.64,25.76 18.69,25.76 18.75,25.81 18.75,27.53 19.66,28.45 19.66,31.14 19.86,31.34 19.86,31.39 19.91,31.45 19.96,31.45 20.02,31.5 20.02,32.66 v20.07,32.72
  Bottom 0.279: U1.38 40.66,33.05 38.28,30.66 37.74,31.19 36.22,31.19 36.02,31.39 33.48,31.39 33.07,31.8 20.98,31.8 v20.07,32.72 | JP3.13 21.59,7.98 v23.98,10.36 | v18.8,21.59 v22.05,18.34
N$62  (via drill 1.3)
  Top 0.279: v29.16,17.58 32.16,20.57 32.16,30.79 v34.8,33.43
  Bottom 0.279: U1.41 38.35,34.54 38.1,34.29 38,34.34 37.69,34.65 36.47,34.65 35.26,33.43 v34.8,33.43 | JP3.14 19.2,7.62 v29.16,17.58
N$63  (via drill 1.3)
  Top 0.279: v14.94,16.05 16.1,16.05 21.03,20.98 21.03,25.81 v31.29,36.07
  Bottom 0.279: U1.42 38.61,35.05 38.1,35.56 38,35.61 37.54,36.07 v31.29,36.07 | JP3.15 16.51,11.53 17.27,12.29 17.27,13.72 v14.94,16.05
N$64  (via drill 1.4)
  Top 0.279: v15.49,4.06 10.16,5.08 v2.54,12.7 | v3.81,50.8 21.59,50.8 30.48,60.07 38.1,60.07 v40.64,57.15
  Bottom 0.279: U1.52 48.54,42.9 40.64,50.8 v40.64,57.15 | JP3.16 13.97,5.08 v15.49,4.06 | v2.54,12.7 2.54,49.53 v3.81,50.8

### Text on the board
Bottom: Designed by D.P. Rev 1.